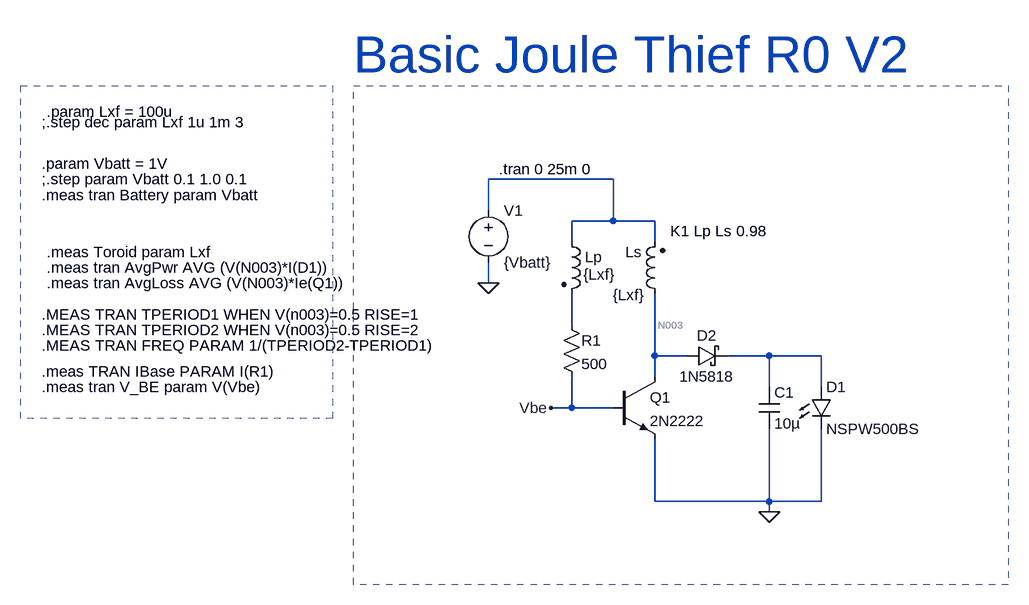
[diagram p0: schematic Joule Thief R0.asc]
Joule Thief R0.asc, the LTspice schematic file:
Version 4
SHEET 1 1580 708
WIRE 272 80 80 80
WIRE 80 128 80 80
WIRE 272 144 272 80
WIRE 272 144 208 144
WIRE 336 144 272 144
WIRE 208 176 208 144
WIRE 336 176 336 144
WIRE 80 240 80 208
WIRE 208 304 208 256
WIRE 336 352 336 256
WIRE 384 352 336 352
WIRE 512 352 448 352
WIRE 592 352 512 352
WIRE 336 384 336 352
WIRE 512 400 512 352
WIRE 592 400 592 352
WIRE 208 432 208 384
WIRE 208 432 176 432
WIRE 272 432 208 432
WIRE 336 576 336 480
WIRE 512 576 512 464
WIRE 512 576 336 576
WIRE 592 576 592 464
WIRE 592 576 512 576
WIRE 512 592 512 576
FLAG 80 240 0
FLAG 176 432 Vbe
FLAG 512 592 0
SYMBOL res 192 288 R0
WINDOW 0 31 40 Left 2
WINDOW 3 31 76 Left 2
SYMATTR InstName R1
SYMATTR Value 500
SYMBOL npn 272 384 R0
SYMATTR InstName Q1
SYMATTR Value 2N2222
SYMBOL LED 576 400 R0
SYMATTR InstName D1
SYMATTR Value NSPW500BS
SYMBOL voltage 80 112 R0
WINDOW 123 0 0 Left 0
WINDOW 39 0 0 Left 0
SYMATTR InstName V1
SYMATTR Value {Vbatt}
SYMBOL ind2 192 160 R0
WINDOW 3 34 67 Left 2
SYMATTR Value {Lxf}
SYMATTR InstName Lp
SYMBOL ind2 352 272 R180
WINDOW 0 36 80 Left 2
WINDOW 3 32 14 Left 2
SYMATTR InstName Ls
SYMATTR Value {Lxf}
SYMBOL schottky 384 368 R270
WINDOW 0 32 32 VTop 2
WINDOW 3 0 32 VBottom 2
SYMATTR InstName D2
SYMATTR Value 1N5818
SYMBOL cap 496 400 R0
SYMATTR InstName C1
SYMATTR Value 10µ
TEXT 96 64 Left 2 !.tran 0 25m 0
TEXT 360 160 Left 2 !K1 Lp Ls 0.98
TEXT -128 -112 Left 6 ;Basic Joule Thief R0 V2
TEXT -600 -24 Left 2 !.param Lxf = 100u
TEXT -608 -8 Left 2 !;.step dec param Lxf 1u 1m 3
TEXT -600 216 Left 2 !.meas tran AvgPwr AVG (V(N003)*I(D1))
TEXT -600 192 Left 2 !.meas Toroid param Lxf
TEXT -608 288 Left 2 !.MEAS TRAN TPERIOD1 WHEN V(n003)=0.5 RISE=1
TEXT -608 312 Left 2 !.MEAS TRAN TPERIOD2 WHEN V(n003)=0.5 RISE=2
TEXT -608 336 Left 2 !.MEAS TRAN FREQ PARAM 1/(TPERIOD2-TPERIOD1)
TEXT -600 240 Left 2 !.meas tran AvgLoss AVG (V(N003)*Ie(Q1))
TEXT -608 56 Left 2 !.param Vbatt = 1V
TEXT -608 80 Left 2 !;.step param Vbatt 0.1 1.0 0.1
TEXT -608 376 Left 2 !.meas TRAN IBase PARAM I(R1)
TEXT -608 104 Left 2 !.meas tran Battery param Vbatt
TEXT -608 400 Left 2 !.meas tran V_BE param V(Vbe)
RECTANGLE Normal -160 448 -640 -64 2
RECTANGLE Normal 880 704 -128 -64 2

The netlist it stands for:
* Joule Thief R0.asc
R1 N002 Vbe 500
Q1 N003 Vbe 0 0 2N2222
D1 N004 0 NSPW500BS
V1 N001 0 {Vbatt}
Lp N001 N002 {Lxf}
Ls N003 N001 {Lxf}
D2 N003 N004 1N5818
C1 N004 0 10µ
.model D D
.lib standard.dio
.model NPN NPN
.model PNP PNP
.lib standard.bjt
.tran 0 25m 0
K1 Lp Ls 0.98
* Basic Joule Thief R0 V2
.param Lxf = 100u
;.step dec param Lxf 1u 1m 3
.meas tran AvgPwr AVG (V(N003)*I(D1))
.meas Toroid param Lxf
.MEAS TRAN TPERIOD1 WHEN V(n003)=0.5 RISE=1
.MEAS TRAN TPERIOD2 WHEN V(n003)=0.5 RISE=2
.MEAS TRAN FREQ PARAM 1/(TPERIOD2-TPERIOD1)
.meas tran AvgLoss AVG (V(N003)*Ie(Q1))
.param Vbatt = 1V
;.step param Vbatt 0.1 1.0 0.1
.meas TRAN IBase PARAM I(R1)
.meas tran Battery param Vbatt
.meas tran V_BE param V(Vbe)
.backanno
.end